# Altium schematic sheet RFBoard.SchDoc
size A3; Organization: Senic GmbH; Address1: Aufgang J; Address2: Köpenicker Str. 154; Address3: Berlin 10997; Address4: Germany
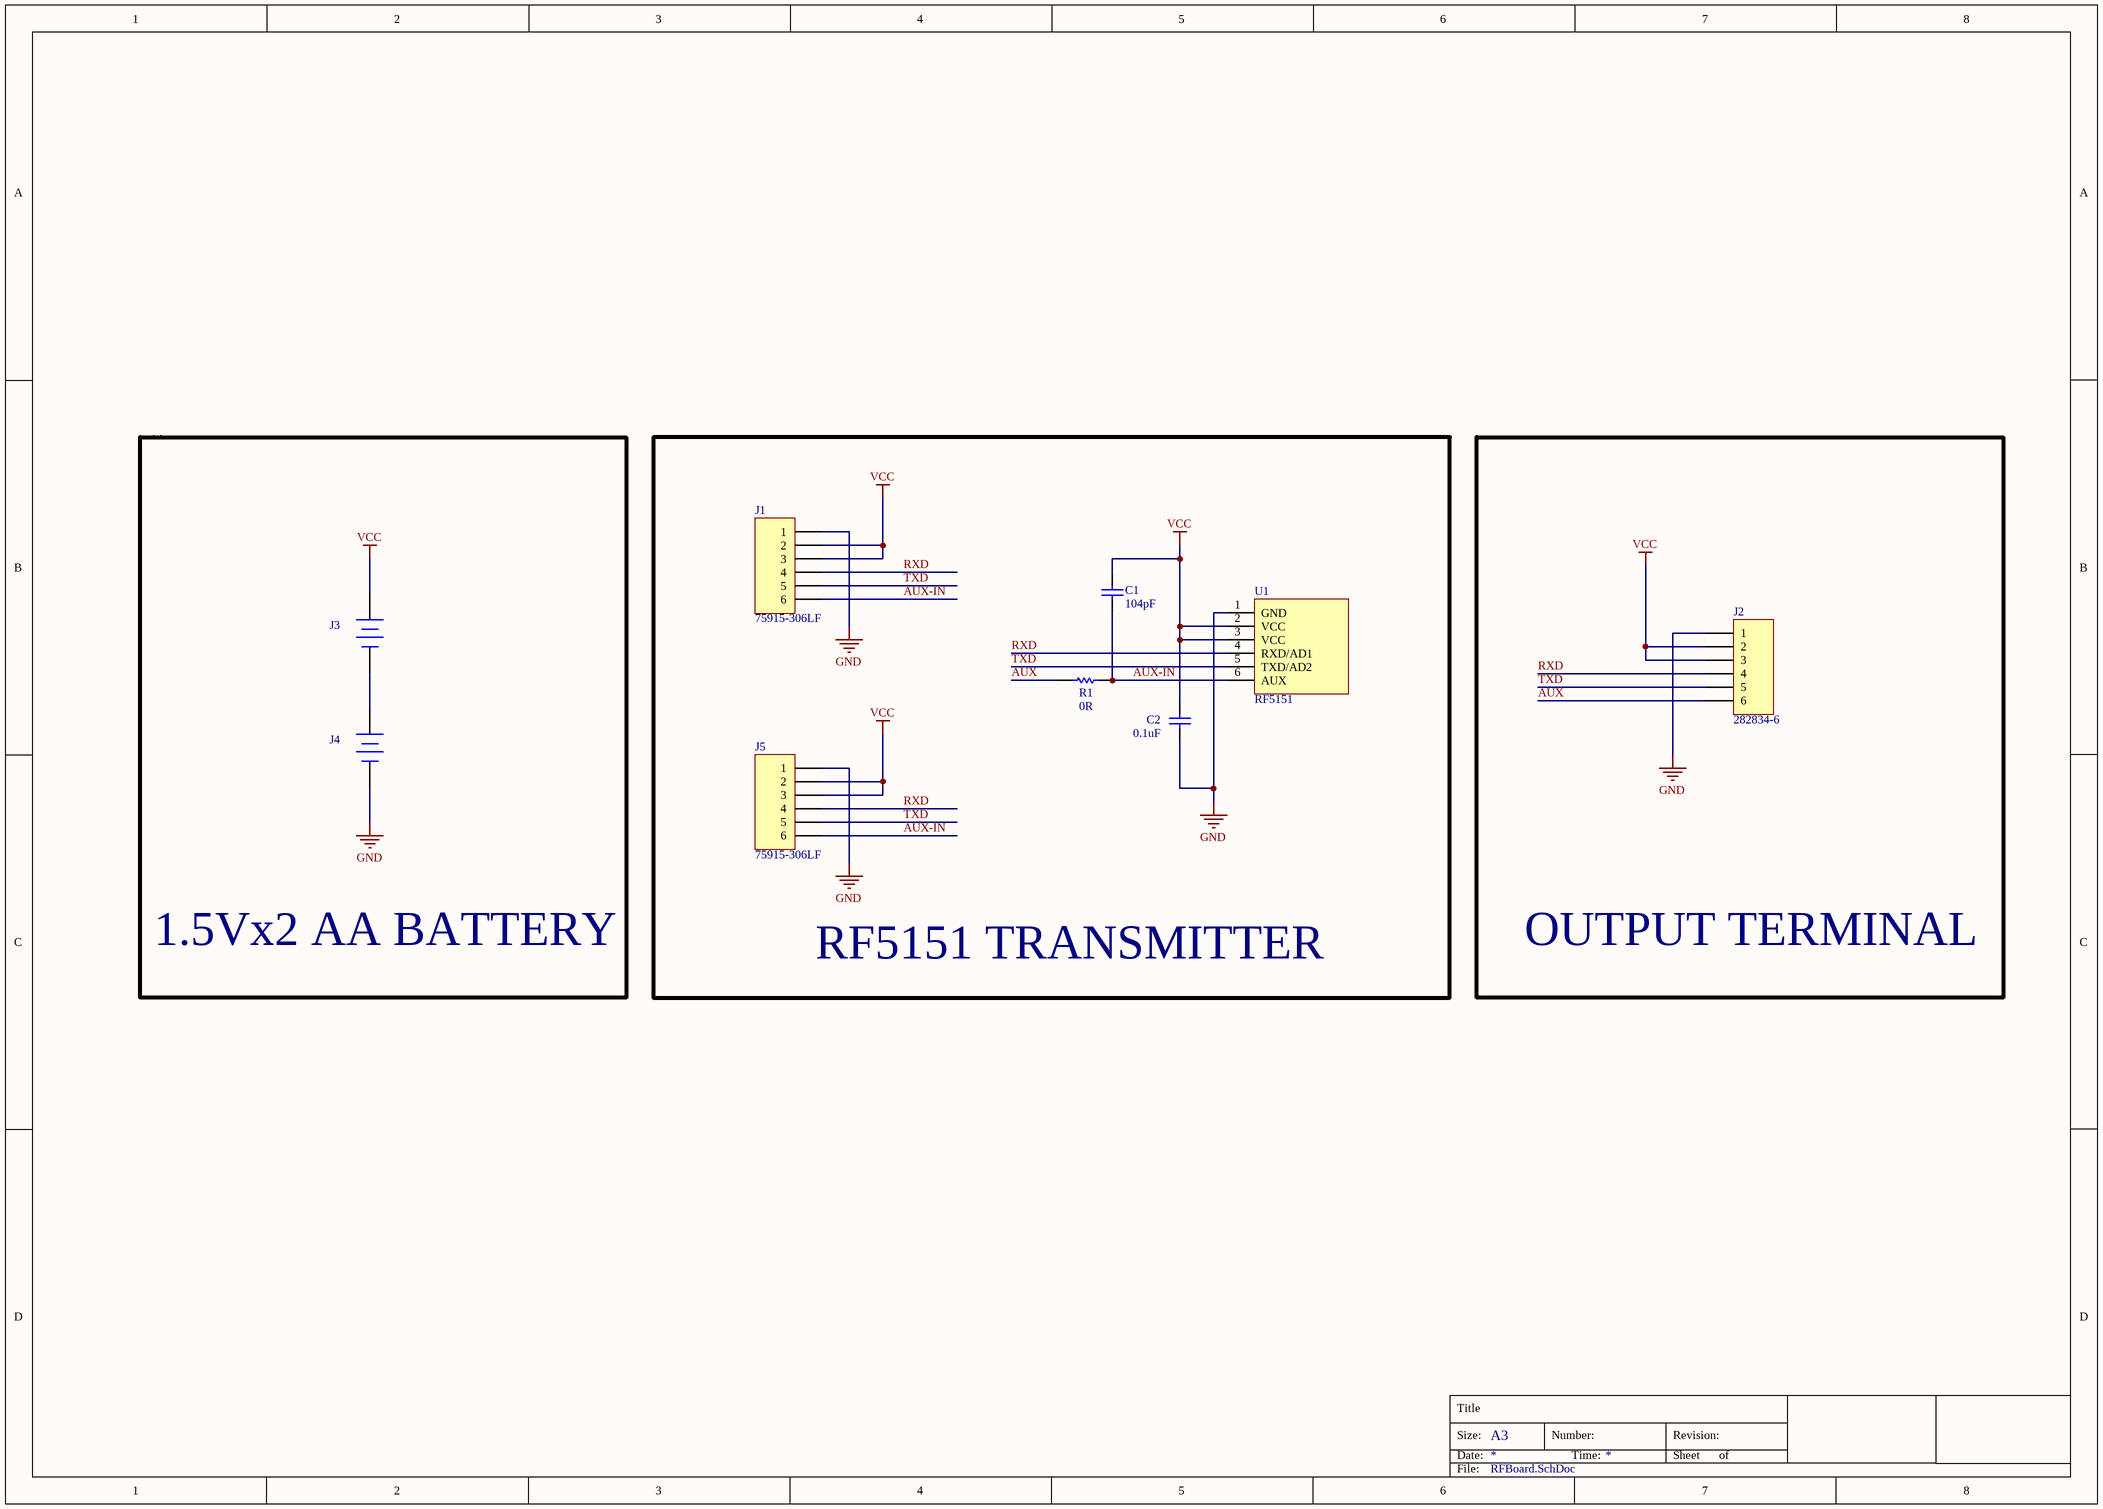
[diagram p0: RFBoard.SchDoc]

## Parts
C1  104pF  [C1206]
C2  0.1uF  [C1206]
J1  75915-306LF  [HDR1X6_FEMALE-(75915-306LF)]
J2  282834-6  [TB1X6_P2.54-(282834-6)]
J3  BATT-2PIN  [BATT-AA-1]  (value not drawn)
J4  BATT-2PIN  [BATT-AA-1]  (value not drawn)
J5  75915-306LF  [HDR1X6_FEMALE-(75915-306LF)]
R1  0R  [R1206-SHORT]
U1  RF5151  [RF5151]

## Blocks framed on the sheet
RF5151 TRANSMITTER: C1 C2 J1 J5 R1 U1
OUTPUT TERMINAL: J2

## Nets
GND: C2.2 J1.1 J2.1 J4.2(-) J5.1 U1.1(GND)
VCC: C1.2 C2.1 J1.2 J1.3 J2.2 J2.3 J3.1(+) J5.2 J5.3 U1.2(VCC) U1.3(VCC)
AUX: J2.6 R1.1
AUX-IN: C1.1 J1.6 J5.6 R1.2 U1.6(AUX)
RXD: J1.4 J2.4 J5.4 U1.4(RXD/AD1)
TXD: J1.5 J2.5 J5.5 U1.5(TXD/AD2)
NetJ3_2: J3.2(-) J4.1(+)

## Notes on the sheet
- 1.5Vx2 AA BATTERY
- Title
- Size:
- Date:
- A3
- Number:
- Time:
- Revision:
- Sheet
- of
- File:

## Library data of the parts
C1 C2 = CAP_CERAMIC
J1 J2 J5 = HDR1X6
R1 = RES: MFR Part No.: *
U1 = RF5151: MFR Part No.: RF5151